# EAGLE schematic main (EAGLE 9.5.0)

## Sheet 1 of 7: ADE9000
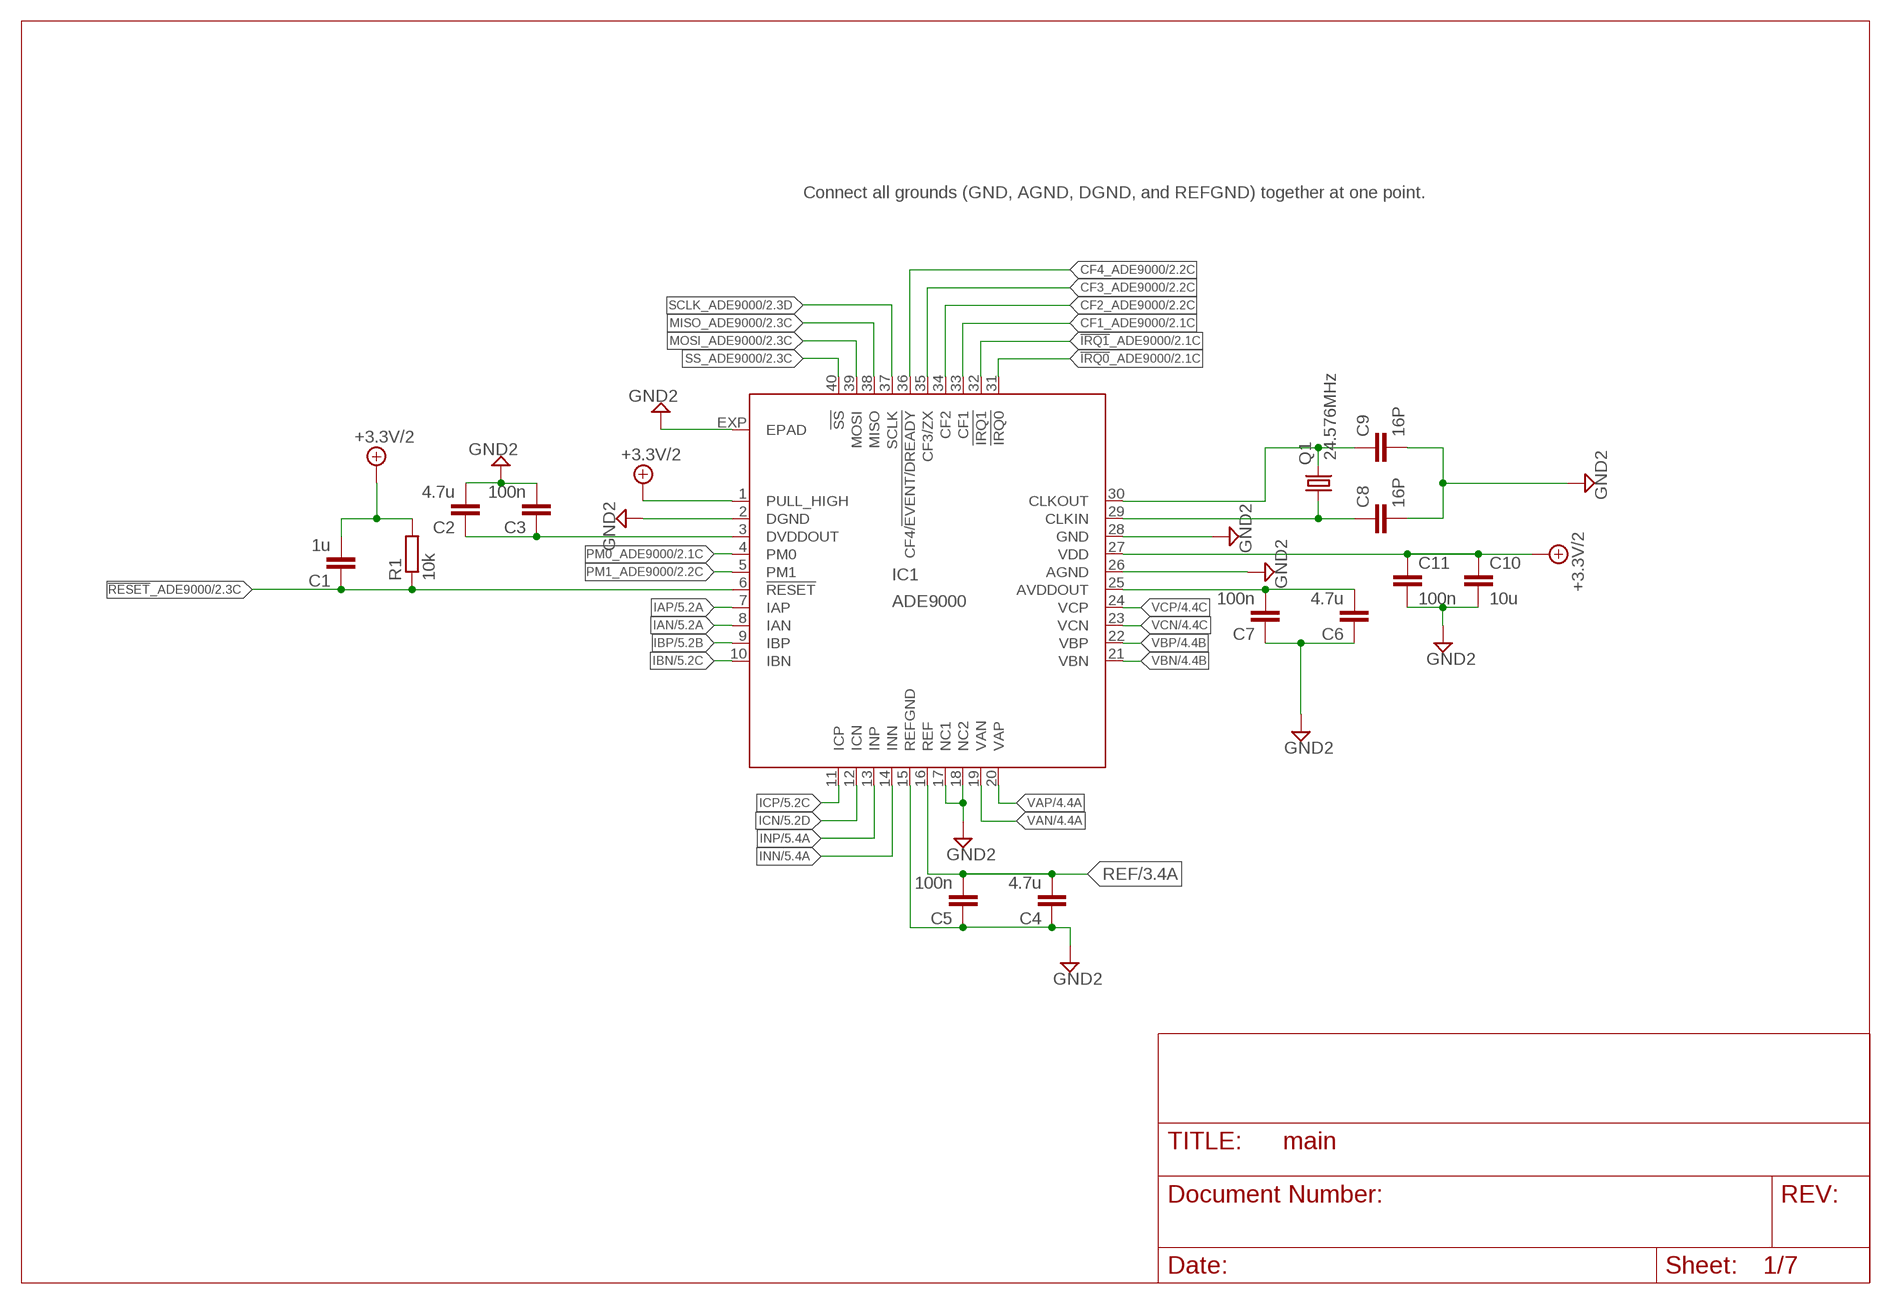
[diagram p0: schematic, sheet 1]

### Parts
C1  1u  C-EUC0805  [C0805]
C2  4.7u  C-EUC0805  [C0805]
C3  100n  C-EUC0805  [C0805]
C4  4.7u  C-EUC0805  [C0805]
C5  100n  C-EUC0805  [C0805]
C6  4.7u  C-EUC0805  [C0805]
C7  100n  C-EUC0805  [C0805]
C8  16P  C-EUC0805K  [C0805K]
C9  16P  C-EUC0805K  [C0805K]
C10  10u  C-EUC1206K  [C1206K]
C11  100n  C-EUC0805  [C0805]
IC1  ADE9000  [QFN40]
Q1  24.576MHz  CRYSTALHC49UP  [HC49UP]
R1  10k  R-EU_R0805  [R0805]

### Nets
!IRQ0!_ADE9000: IC1.31(!IRQ0) ; also sheet 2
!IRQ1!_ADE9000: IC1.32(!IRQ1) ; also sheet 2
!RESET!_ADE9000: C1.1 IC1.6(!RESET) R1.1 ; also sheet 2
+3.3V/2: C1.2 C10.1 C11.1 IC1.1(PULL_HIGH) IC1.27(VDD) R1.2 ; also sheet 2,3
CF1_ADE9000: IC1.33(CF1) ; also sheet 2
CF2_ADE9000: IC1.34(CF2) ; also sheet 2
CF3_ADE9000: IC1.35(CF3/ZX) ; also sheet 2
CF4_ADE9000: IC1.36(CF4/!EVENT/DREADY) ; also sheet 2
GND2: C2.2 C3.2 C4.1 C5.1 C6.1 C7.1 C8.2 C9.2 C10.2 C11.2 IC1.2(DGND) IC1.15(REFGND) IC1.17(NC1) IC1.18(NC2) IC1.26(AGND) IC1.28(GND) IC1.EXP(EPAD) ; also sheet 2,3,4,5
IAN: IC1.8(IAN) ; also sheet 5
IAP: IC1.7(IAP) ; also sheet 5
IBN: IC1.10(IBN) ; also sheet 5
IBP: IC1.9(IBP) ; also sheet 5
ICN: IC1.12(ICN) ; also sheet 5
ICP: IC1.11(ICP) ; also sheet 5
INN: IC1.14(INN) ; also sheet 5
INP: IC1.13(INP) ; also sheet 5
MISO_ADE9000: IC1.38(MISO) ; also sheet 2
MOSI_ADE9000: IC1.39(MOSI) ; also sheet 2
N$13: C2.1 C3.1 IC1.3(DVDDOUT)
N$21: C6.2 C7.2 IC1.25(AVDDOUT)
N$30: C8.1 IC1.29(CLKIN) Q1.1
N$31: C9.1 IC1.30(CLKOUT) Q1.2
PM0_ADE9000: IC1.4(PM0) ; also sheet 2
PM1_ADE9000: IC1.5(PM1) ; also sheet 2
REF: C4.2 C5.2 IC1.16(REF) ; also sheet 3
SCLK_ADE9000: IC1.37(SCLK) ; also sheet 2
SS_ADE9000: IC1.40(!SS) ; also sheet 2
VAN: IC1.19(VAN) ; also sheet 4
VAP: IC1.20(VAP) ; also sheet 4
VBN: IC1.21(VBN) ; also sheet 4
VBP: IC1.22(VBP) ; also sheet 4
VCN: IC1.23(VCN) ; also sheet 4
VCP: IC1.24(VCP) ; also sheet 4

### Notes on the sheet
- Connect all grounds (GND, AGND, DGND, and REFGND) together at one point.

## Sheet 2 of 7: Digital Isolators
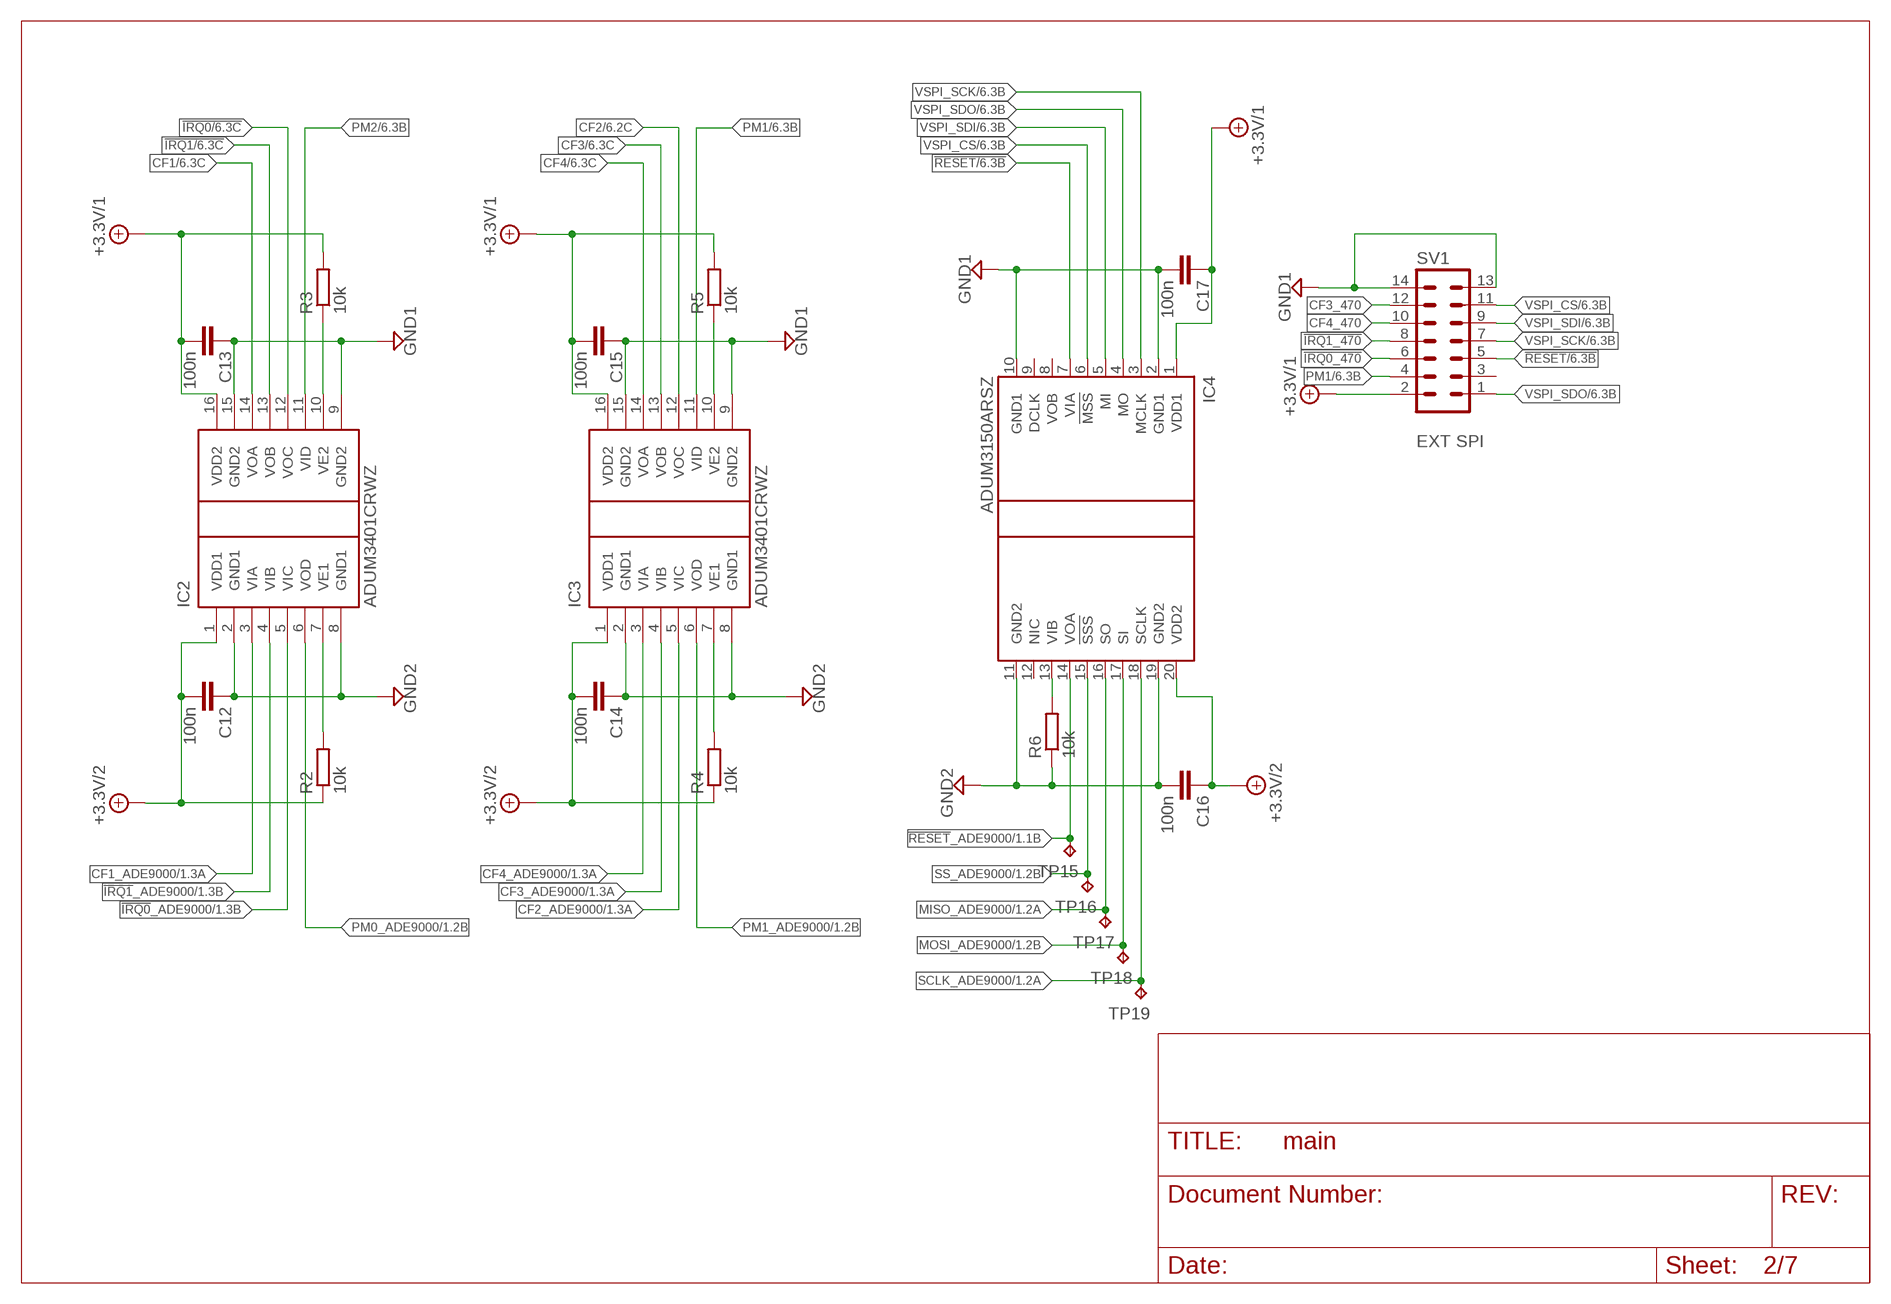
[diagram p1: schematic, sheet 2]

### Parts
C12  100n  C-EUC0805  [C0805]
C13  100n  C-EUC0805  [C0805]
C14  100n  C-EUC0805  [C0805]
C15  100n  C-EUC0805  [C0805]
C16  100n  C-EUC0805  [C0805]
C17  100n  C-EUC0805  [C0805]
IC2  ADUM3401CRWZ  ADUM3401  [SO16W]
IC3  ADUM3401CRWZ  ADUM3401  [SO16W]
IC4  ADUM3150ARSZ  ADUM3150  [SSOP20]
R2  10k  R-EU_R0805  [R0805]
R3  10k  R-EU_R0805  [R0805]
R4  10k  R-EU_R0805  [R0805]
R5  10k  R-EU_R0805  [R0805]
R6  10k  R-EU_R0805  [R0805]
SV1  EXT SPI  ML14  [ML14]
TP15  TPB1,27  [B1,27]
TP16  TPB1,27  [B1,27]
TP17  TPB1,27  [B1,27]
TP18  TPB1,27  [B1,27]
TP19  TPB1,27  [B1,27]

### Nets
!IRQ0: IC2.12(VOC) ; also sheet 6
!IRQ0!_ADE9000: IC2.5(VIC) ; also sheet 1
!IRQ0_470: SV1.6 ; also sheet 6
!IRQ1: IC2.13(VOB) ; also sheet 6
!IRQ1!_ADE9000: IC2.4(VIB) ; also sheet 1
!IRQ1_470: SV1.8 ; also sheet 6
!RESET: IC4.7(VIA) SV1.5 ; also sheet 6
!RESET!_ADE9000: IC4.14(VOA) TP15.TP ; also sheet 1
+3.3V/1: C13.2 C15.2 C17.1 IC2.16(VDD2) IC3.16(VDD2) IC4.1(VDD1) R3.2 R5.2 SV1.2 ; also sheet 3,6
+3.3V/2: C12.2 C14.2 C16.1 IC2.1(VDD1) IC3.1(VDD1) IC4.20(VDD2) R2.1 R4.1 ; also sheet 1,3
CF1: IC2.14(VOA) ; also sheet 6
CF1_ADE9000: IC2.3(VIA) ; also sheet 1
CF2: IC3.12(VOC) ; also sheet 6
CF2_ADE9000: IC3.5(VIC) ; also sheet 1
CF3: IC3.13(VOB) ; also sheet 6
CF3_470: SV1.12 ; also sheet 6
CF3_ADE9000: IC3.4(VIB) ; also sheet 1
CF4: IC3.14(VOA) ; also sheet 6
CF4_470: SV1.10 ; also sheet 6
CF4_ADE9000: IC3.3(VIA) ; also sheet 1
GND1: C13.1 C15.1 C17.2 IC2.9(GND2) IC2.15(GND2) IC3.9(GND2) IC3.15(GND2) IC4.2(GND1) IC4.10(GND1) SV1.13 SV1.14 ; also sheet 3,6,7
GND2: C12.1 C14.1 C16.2 IC2.2(GND1) IC2.8(GND1) IC3.2(GND1) IC3.8(GND1) IC4.11(GND2) IC4.19(GND2) R6.1 ; also sheet 1,3,4,5
MISO_ADE9000: IC4.16(SO) TP17.TP ; also sheet 1
MOSI_ADE9000: IC4.17(SI) TP18.TP ; also sheet 1
N$27: IC2.10(VE2) R3.1
N$29: IC4.13(VIB) R6.2
N$32: IC3.7(VE1) R4.2
N$33: IC3.10(VE2) R5.1
N$35: IC2.7(VE1) R2.2
PM0_ADE9000: IC2.6(VOD) ; also sheet 1
PM1: IC3.11(VID) SV1.4 ; also sheet 6
PM1_ADE9000: IC3.6(VOD) ; also sheet 1
PM2: IC2.11(VID) ; also sheet 6
SCLK_ADE9000: IC4.18(SCLK) TP19.TP ; also sheet 1
SS_ADE9000: IC4.15(!SSS) TP16.TP ; also sheet 1
VSPI_CS: IC4.6(!MSS) SV1.11 ; also sheet 6
VSPI_SCK: IC4.3(MCLK) SV1.7 ; also sheet 6
VSPI_SDI: IC4.5(MI) SV1.9 ; also sheet 6
VSPI_SDO: IC4.4(MO) SV1.1 ; also sheet 6
Unconnected: IC4.8(VOB) IC4.9(DCLK) IC4.12(NIC) SV1.3

## Sheet 3 of 7: Power Supply
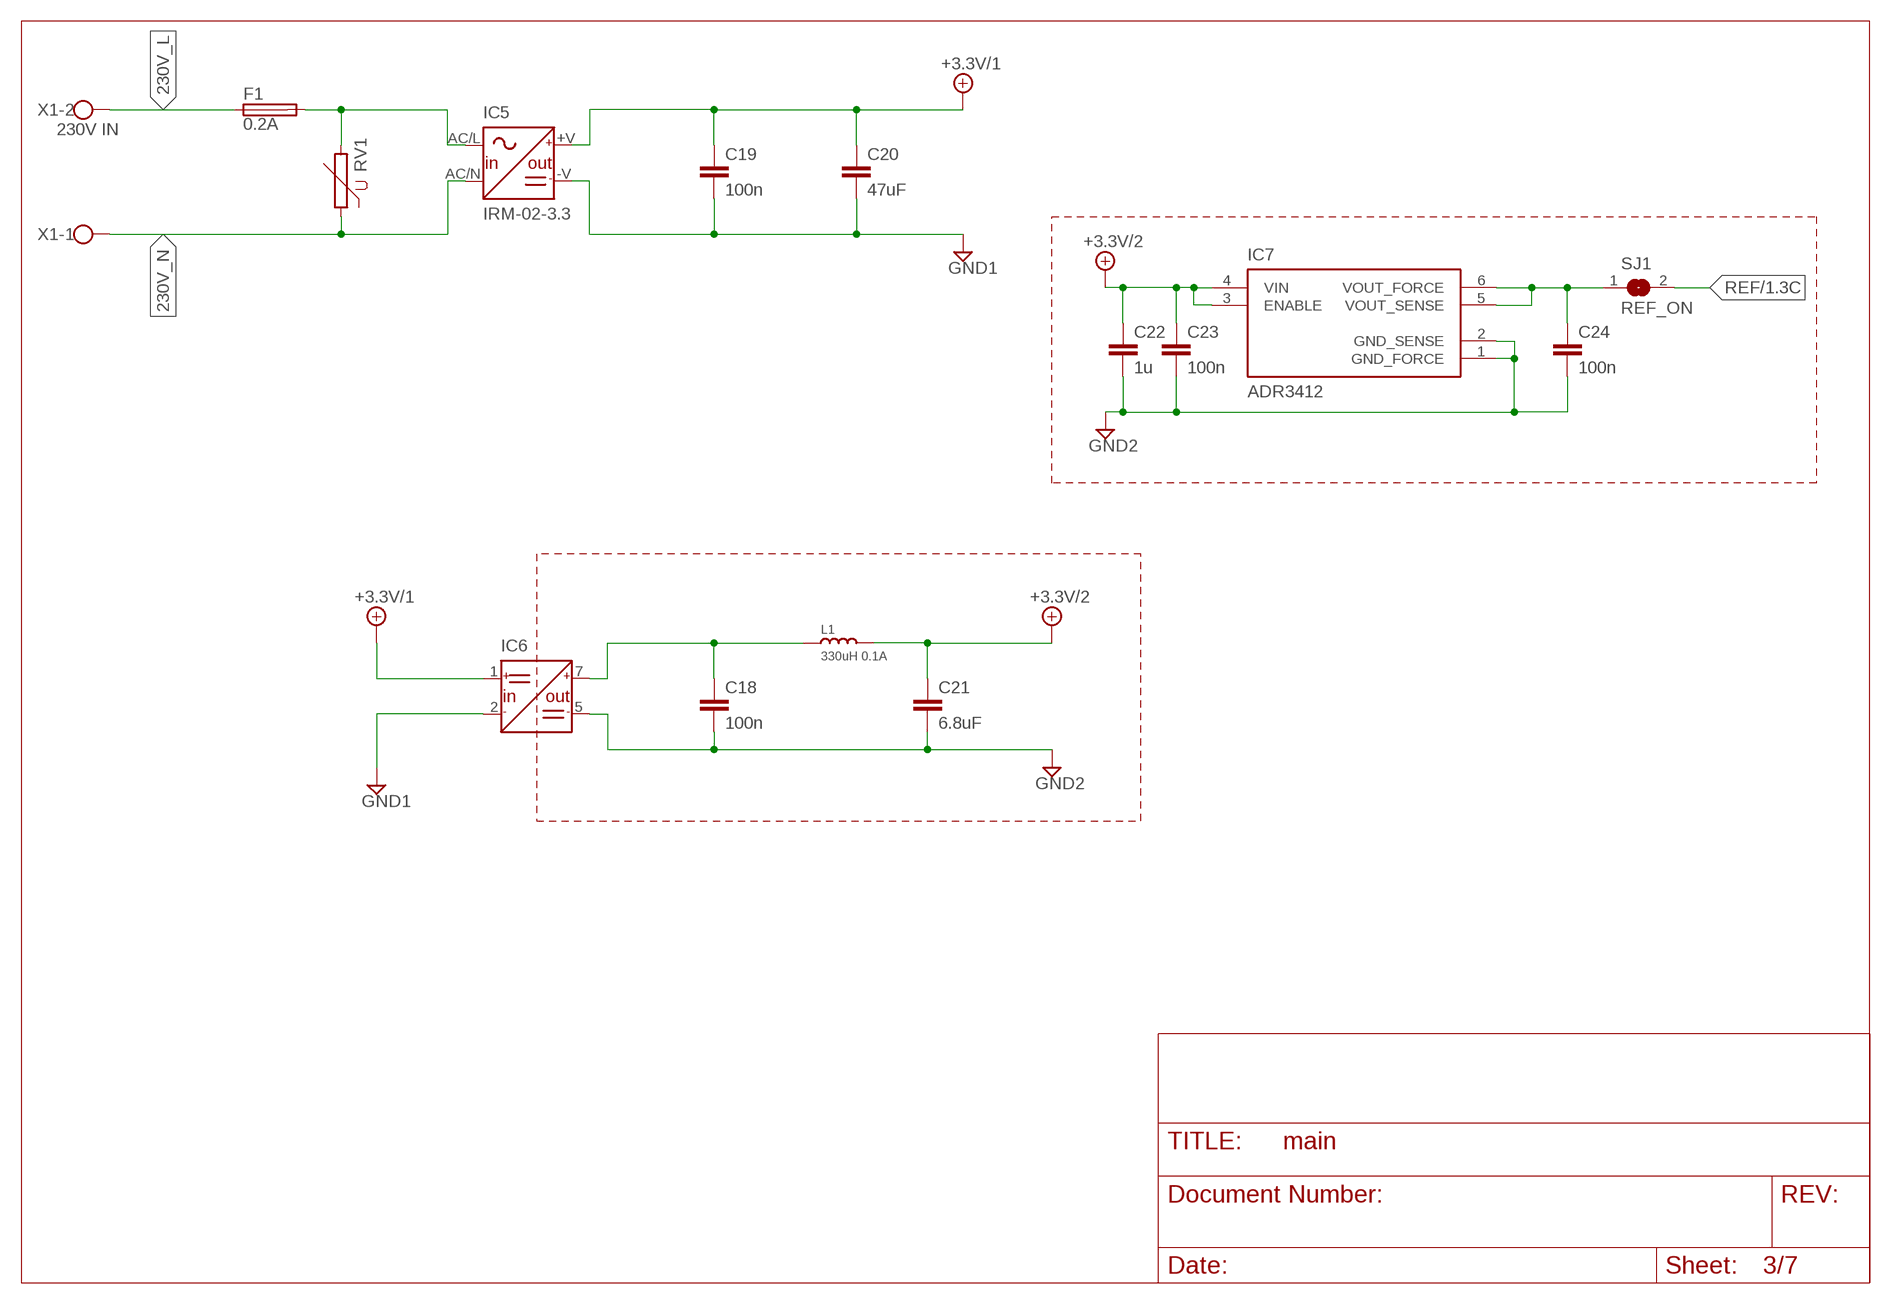
[diagram p2: schematic, sheet 3]

### Parts
C18  100n  C-EUC0805  [C0805]
C19  100n  C-EUC0805  [C0805]
C20  47uF  C-EUC3216  [C3216]
C21  6.8uF  C-EUC3216  [C3216]
C22  1u  C-EUC0805  [C0805]
C23  100n  C-EUC0805  [C0805]
C24  100n  C-EUC0805  [C0805]
F1  0.2A  FUSESH22,5A  [SH22,5A]
IC5  IRM-02-3.3  [MW_IRM-02]
IC6  MURATA-PS-MEF1SXXXXSP3C  [SIP-7PIN-1257]
IC7  ADR3412  [SOT-23-6]
L1  330uH 0.1A  SMD-INDUCTOR-4.7UH-20%-1.1A(1008)  [L1008]
RV1  B72210S0321K101  [TDK_E7.5_A2.4_W12.0_TH5.4_H15.0_D0.8]
SJ1  REF_ON  SJ  [SJ]
X1  230V IN  W237-113  [W237-113]

### Nets
230V_L: F1.1 X1.2
230V_N: IC5.AC/N(N) RV1.1 X1.1
+3.3V/1: C19.1 C20.1 IC5.+V(+V_OUT) IC6.1(+V_IN) ; also sheet 2,6
+3.3V/2: C21.1 C22.1 C23.1 IC7.3(ENABLE) IC7.4(VIN) L1.2 ; also sheet 1,2
GND1: C19.2 C20.2 IC5.-V(-V_OUT) IC6.2(-V_IN) ; also sheet 2,6,7
GND2: C18.2 C21.2 C22.2 C23.2 C24.2 IC6.5(-V_OUT) IC7.1(GND_FORCE) IC7.2(GND_SENSE) ; also sheet 1,2,4,5
N$20: C18.1 IC6.7(+V_OUT) L1.1
N$23: F1.2 IC5.AC/L(L) RV1.2
N$36: C24.1 IC7.5(VOUT_SENSE) IC7.6(VOUT_FORCE) SJ1.1
REF: SJ1.2 ; also sheet 1

## Sheet 4 of 7: Voltage ADC Front-end
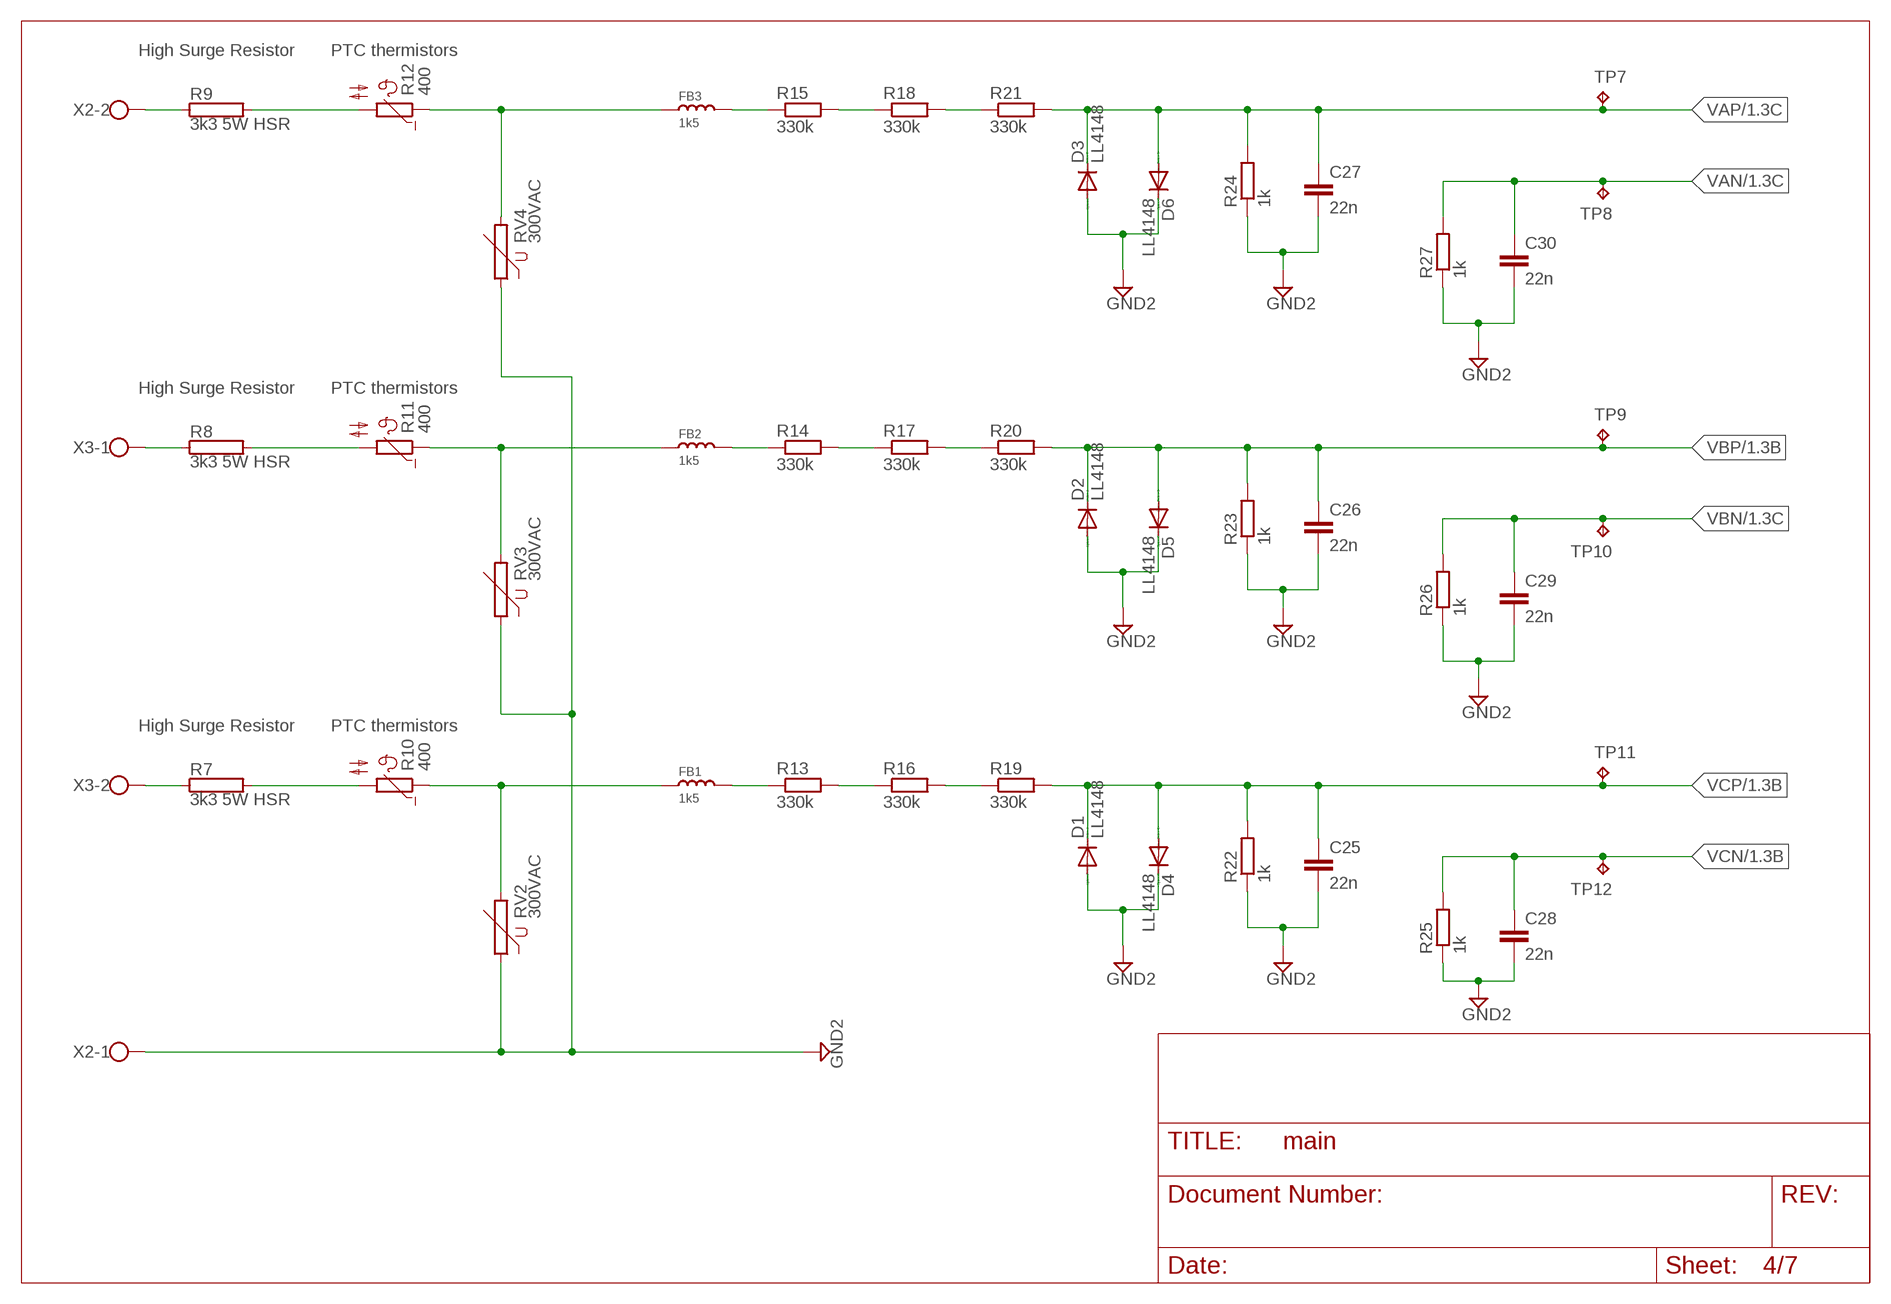
[diagram p3: schematic, sheet 4]

### Parts
C25  22n  C-EUC0805  [C0805]
C26  22n  C-EUC0805  [C0805]
C27  22n  C-EUC0805  [C0805]
C28  22n  C-EUC0805  [C0805]
C29  22n  C-EUC0805  [C0805]
C30  22n  C-EUC0805  [C0805]
D1  LL4148  DIODE-SOD80C  [SOD80C]
D2  LL4148  DIODE-SOD80C  [SOD80C]
D3  LL4148  DIODE-SOD80C  [SOD80C]
D4  LL4148  DIODE-SOD80C  [SOD80C]
D5  LL4148  DIODE-SOD80C  [SOD80C]
D6  LL4148  DIODE-SOD80C  [SOD80C]
FB1  1k5  SMD-FERRITE-BEAD-30R-3A(0805)  [L0805]
FB2  1k5  SMD-FERRITE-BEAD-30R-3A(0805)  [L0805]
FB3  1k5  SMD-FERRITE-BEAD-30R-3A(0805)  [L0805]
R7  3k3 5W HSR  RAC05  [AC05]
R8  3k3 5W HSR  RAC05  [AC05]
R9  3k3 5W HSR  RAC05  [AC05]
R10  400  PTCCL10H010SBE  [PTCCL10H010SBE]
R11  400  PTCCL10H010SBE  [PTCCL10H010SBE]
R12  400  PTCCL10H010SBE  [PTCCL10H010SBE]
R13  330k  R-EU_R1206  [R1206]
R14  330k  R-EU_R1206  [R1206]
R15  330k  R-EU_R1206  [R1206]
R16  330k  R-EU_R1206  [R1206]
R17  330k  R-EU_R1206  [R1206]
R18  330k  R-EU_R1206  [R1206]
R19  330k  R-EU_R1206  [R1206]
R20  330k  R-EU_R1206  [R1206]
R21  330k  R-EU_R1206  [R1206]
R22  1k  R-EU_R1206  [R1206]
R23  1k  R-EU_R1206  [R1206]
R24  1k  R-EU_R1206  [R1206]
R25  1k  R-EU_R1206  [R1206]
R26  1k  R-EU_R1206  [R1206]
R27  1k  R-EU_R1206  [R1206]
RV2  300VAC  B72220S0301K101  [TDK_E10.0_A2.4_W21.5_TH5.6_H25.5_D1.0]
RV3  300VAC  B72220S0301K101  [TDK_E10.0_A2.4_W21.5_TH5.6_H25.5_D1.0]
RV4  300VAC  B72220S0301K101  [TDK_E10.0_A2.4_W21.5_TH5.6_H25.5_D1.0]
TP7  TPB1,27  [B1,27]
TP8  TPB1,27  [B1,27]
TP9  TPB1,27  [B1,27]
TP10  TPB1,27  [B1,27]
TP11  TPB1,27  [B1,27]
TP12  TPB1,27  [B1,27]
X2  W237-113  [W237-113]
X3  W237-113  [W237-113]

### Nets
GND2: C25.2 C26.2 C27.2 C28.2 C29.2 C30.2 D1.A D2.A D3.A D4.C D5.C D6.C R22.1 R23.1 R24.1 R25.1 R26.1 R27.1 RV2.1 RV3.1 RV4.1 X2.1 ; also sheet 1,2,3,5
N$1: R9.2 R12.2
N$2: FB3.1 R12.1 RV4.2
N$4: FB3.2 R15.1
N$5: R8.2 R11.2
N$6: FB2.1 R11.1 RV3.2
N$7: R7.1 X3.2
N$8: R15.2 R18.1
N$9: FB2.2 R14.1
N$10: R14.2 R17.1
N$11: R17.2 R20.1
N$12: R18.2 R21.1
N$14: R7.2 R10.2
N$15: FB1.1 R10.1 RV2.2
N$16: R8.1 X3.1
N$17: FB1.2 R13.1
N$18: R13.2 R16.1
N$19: R16.2 R19.1
N$53: R9.1 X2.2
VAN: C30.1 R27.2 TP8.TP ; also sheet 1
VAP: C27.1 D3.C D6.A R21.2 R24.2 TP7.TP ; also sheet 1
VBN: C29.1 R26.2 TP10.TP ; also sheet 1
VBP: C26.1 D2.C D5.A R20.2 R23.2 TP9.TP ; also sheet 1
VCN: C28.1 R25.2 TP12.TP ; also sheet 1
VCP: C25.1 D1.C D4.A R19.2 R22.2 TP11.TP ; also sheet 1

### Notes on the sheet
- High Surge Resistor | PTC thermistors
- High Surge Resistor | PTC thermistors
- High Surge Resistor | PTC thermistors

## Sheet 5 of 7: CurrentADC Front-end
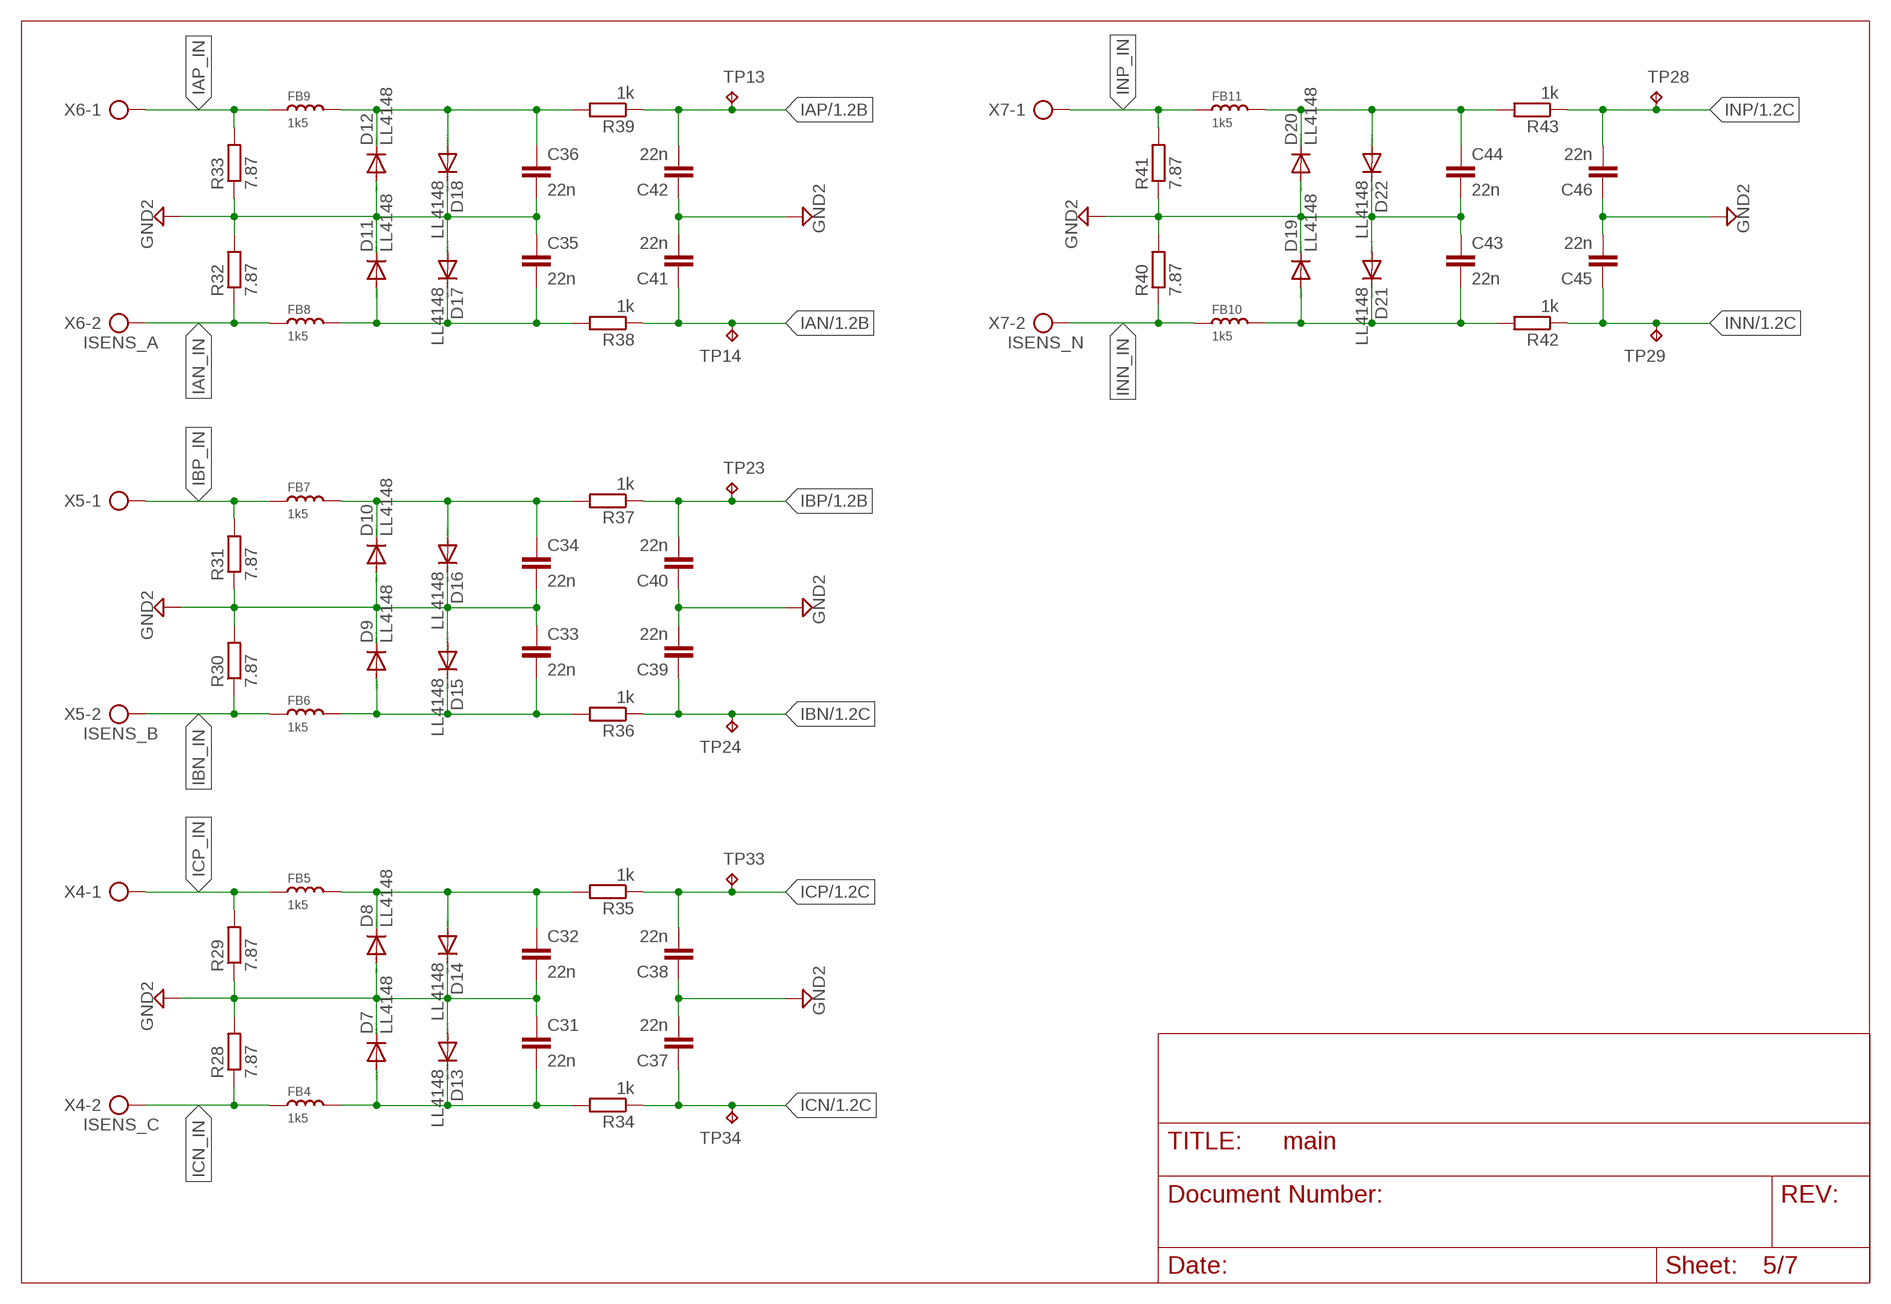
[diagram p4: schematic, sheet 5]

### Parts
C31  22n  C-EUC0805  [C0805]
C32  22n  C-EUC0805  [C0805]
C33  22n  C-EUC0805  [C0805]
C34  22n  C-EUC0805  [C0805]
C35  22n  C-EUC0805  [C0805]
C36  22n  C-EUC0805  [C0805]
C37  22n  C-EUC0805  [C0805]
C38  22n  C-EUC0805  [C0805]
C39  22n  C-EUC0805  [C0805]
C40  22n  C-EUC0805  [C0805]
C41  22n  C-EUC0805  [C0805]
C42  22n  C-EUC0805  [C0805]
C43  22n  C-EUC0805  [C0805]
C44  22n  C-EUC0805  [C0805]
C45  22n  C-EUC0805  [C0805]
C46  22n  C-EUC0805  [C0805]
D7  LL4148  DIODE-SOD80C  [SOD80C]
D8  LL4148  DIODE-SOD80C  [SOD80C]
D9  LL4148  DIODE-SOD80C  [SOD80C]
D10  LL4148  DIODE-SOD80C  [SOD80C]
D11  LL4148  DIODE-SOD80C  [SOD80C]
D12  LL4148  DIODE-SOD80C  [SOD80C]
D13  LL4148  DIODE-SOD80C  [SOD80C]
D14  LL4148  DIODE-SOD80C  [SOD80C]
D15  LL4148  DIODE-SOD80C  [SOD80C]
D16  LL4148  DIODE-SOD80C  [SOD80C]
D17  LL4148  DIODE-SOD80C  [SOD80C]
D18  LL4148  DIODE-SOD80C  [SOD80C]
D19  LL4148  DIODE-SOD80C  [SOD80C]
D20  LL4148  DIODE-SOD80C  [SOD80C]
D21  LL4148  DIODE-SOD80C  [SOD80C]
D22  LL4148  DIODE-SOD80C  [SOD80C]
FB4  1k5  SMD-FERRITE-BEAD-30R-3A(0805)  [L0805]
FB5  1k5  SMD-FERRITE-BEAD-30R-3A(0805)  [L0805]
FB6  1k5  SMD-FERRITE-BEAD-30R-3A(0805)  [L0805]
FB7  1k5  SMD-FERRITE-BEAD-30R-3A(0805)  [L0805]
FB8  1k5  SMD-FERRITE-BEAD-30R-3A(0805)  [L0805]
FB9  1k5  SMD-FERRITE-BEAD-30R-3A(0805)  [L0805]
FB10  1k5  SMD-FERRITE-BEAD-30R-3A(0805)  [L0805]
FB11  1k5  SMD-FERRITE-BEAD-30R-3A(0805)  [L0805]
R28  7.87  R-EU_R1206  [R1206]
R29  7.87  R-EU_R1206  [R1206]
R30  7.87  R-EU_R1206  [R1206]
R31  7.87  R-EU_R1206  [R1206]
R32  7.87  R-EU_R1206  [R1206]
R33  7.87  R-EU_R1206  [R1206]
R34  1k  R-EU_R1206  [R1206]
R35  1k  R-EU_R1206  [R1206]
R36  1k  R-EU_R1206  [R1206]
R37  1k  R-EU_R1206  [R1206]
R38  1k  R-EU_R1206  [R1206]
R39  1k  R-EU_R1206  [R1206]
R40  7.87  R-EU_R1206  [R1206]
R41  7.87  R-EU_R1206  [R1206]
R42  1k  R-EU_R1206  [R1206]
R43  1k  R-EU_R1206  [R1206]
TP13  TPB1,27  [B1,27]
TP14  TPB1,27  [B1,27]
TP23  TPB1,27  [B1,27]
TP24  TPB1,27  [B1,27]
TP28  TPB1,27  [B1,27]
TP29  TPB1,27  [B1,27]
TP33  TPB1,27  [B1,27]
TP34  TPB1,27  [B1,27]
X4  ISENS_C  AK500/2  [AK500/2]
X5  ISENS_B  AK500/2  [AK500/2]
X6  ISENS_A  AK500/2  [AK500/2]
X7  ISENS_N  AK500/2  [AK500/2]

### Nets
GND2: C31.1 C32.2 C33.1 C34.2 C35.1 C36.2 C37.2 C38.1 C39.2 C40.1 C41.2 C42.1 C43.1 C44.2 C45.2 C46.1 D7.C D8.A D9.C D10.A D11.C D12.A D13.A D14.C D15.A D16.C D17.A D18.C D19.C D20.A D21.A D22.C R28.2 R29.1 R30.2 R31.1 R32.2 R33.1 R40.2 R41.1 ; also sheet 1,2,3,4
IAN: C41.1 R38.1 TP14.TP ; also sheet 1
IAN_IN: FB8.1 R32.1 X6.2
IAP: C42.2 R39.1 TP13.TP ; also sheet 1
IAP_IN: FB9.1 R33.2 X6.1
IBN: C39.1 R36.1 TP24.TP ; also sheet 1
IBN_IN: FB6.1 R30.1 X5.2
IBP: C40.2 R37.1 TP23.TP ; also sheet 1
IBP_IN: FB7.1 R31.2 X5.1
ICN: C37.1 R34.1 TP34.TP ; also sheet 1
ICN_IN: FB4.1 R28.1 X4.2
ICP: C38.2 R35.1 TP33.TP ; also sheet 1
ICP_IN: FB5.1 R29.2 X4.1
INN: C45.1 R42.1 TP29.TP ; also sheet 1
INN_IN: FB10.1 R40.1 X7.2
INP: C46.2 R43.1 TP28.TP ; also sheet 1
INP_IN: FB11.1 R41.2 X7.1
N$22: C33.2 D9.A D15.C FB6.2 R36.2
N$24: C43.2 D19.A D21.C FB10.2 R42.2
N$25: C31.2 D7.A D13.C FB4.2 R34.2
N$28: C35.2 D11.A D17.C FB8.2 R38.2
VBN1: C36.1 D12.C D18.A FB9.2 R39.2
VBN2: C34.1 D10.C D16.A FB7.2 R37.2
VBN3: C44.1 D20.C D22.A FB11.2 R43.2
VBN4: C32.1 D8.C D14.A FB5.2 R35.2

## Sheet 6 of 7: ESP32
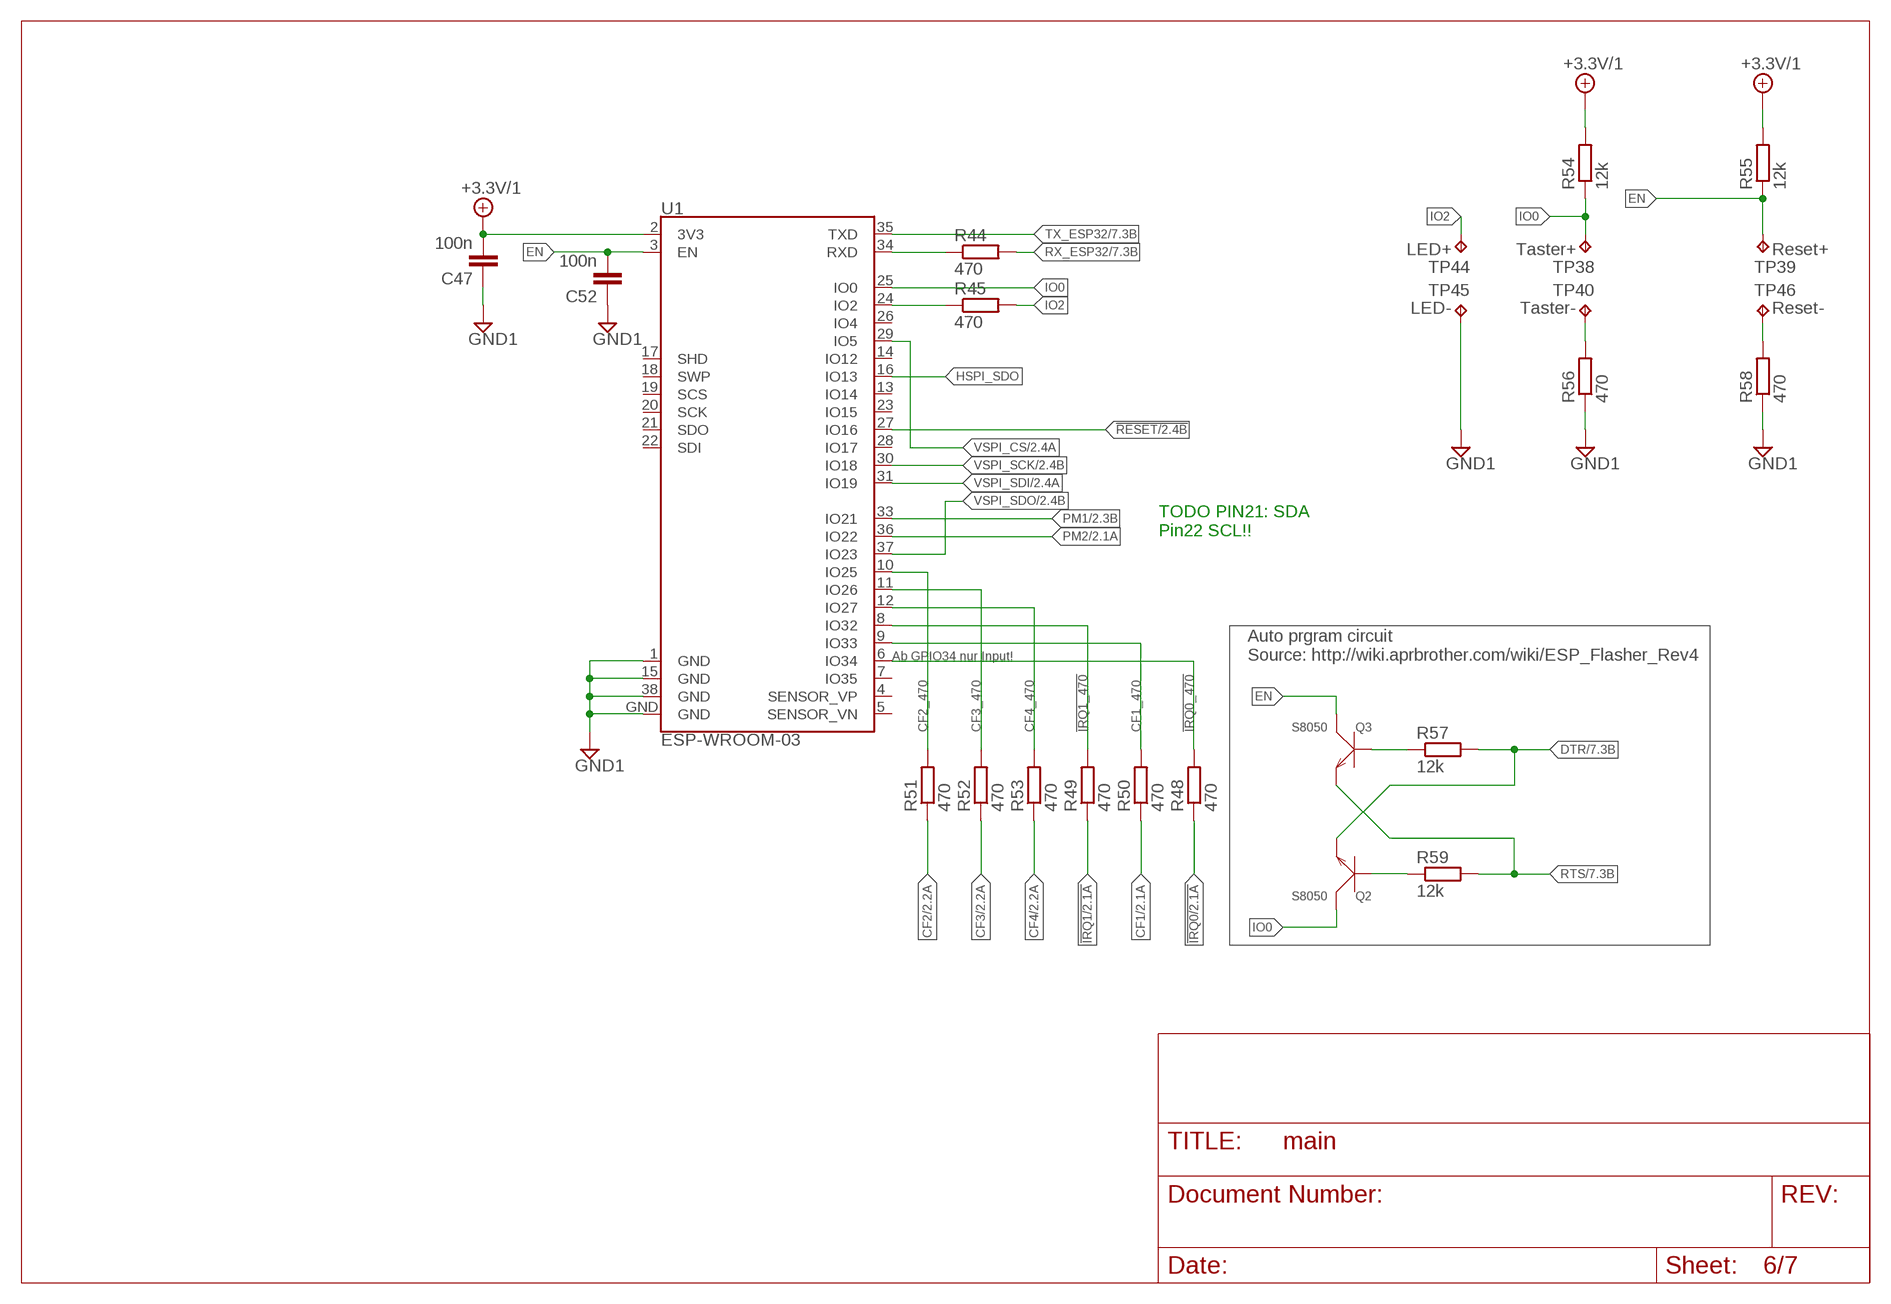
[diagram p5: schematic, sheet 6]

### Parts
C47  100n  C-EUC0805  [C0805]
C52  100n  C-EUC0805  [C0805]
Q2  S8050  SMD-TRANSISTORS-NPN-25V-500MW-S8050(SOT-23)  [SOT-23]
Q3  S8050  SMD-TRANSISTORS-NPN-25V-500MW-S8050(SOT-23)  [SOT-23]
R44  470  R-EU_R0805  [R0805]
R45  470  R-EU_R0805  [R0805]
R48  470  R-EU_R0805  [R0805]
R49  470  R-EU_R0805  [R0805]
R50  470  R-EU_R0805  [R0805]
R51  470  R-EU_R0805  [R0805]
R52  470  R-EU_R0805  [R0805]
R53  470  R-EU_R0805  [R0805]
R54  12k  R-EU_R0805  [R0805]
R55  12k  R-EU_R0805  [R0805]
R56  470  R-EU_R0805  [R0805]
R57  12k  R-EU_R0805  [R0805]
R58  470  R-EU_R0805  [R0805]
R59  12k  R-EU_R0805  [R0805]
TP38  TPPAD1-13Y  [P1-13Y]
TP39  TPPAD1-13Y  [P1-13Y]
TP40  TPPAD1-13Y  [P1-13Y]
TP44  TPPAD1-13Y  [P1-13Y]
TP45  TPPAD1-13Y  [P1-13Y]
TP46  TPPAD1-13Y  [P1-13Y]
U1  ESP-WROOM-03  [ESP-WROOM-03]

### Nets
!IRQ0: R48.1 ; also sheet 2
!IRQ0_470: R48.2 U1.6(IO34) ; also sheet 2
!IRQ1: R49.1 ; also sheet 2
!IRQ1_470: R49.2 U1.8(IO32) ; also sheet 2
!RESET: U1.27(IO16) ; also sheet 2
+3.3V/1: C47.2 R54.2 R55.2 U1.2(3V3) ; also sheet 2,3
CF1: R50.1 ; also sheet 2
CF1_470: R50.2 U1.9(IO33)
CF2: R51.1 ; also sheet 2
CF2_470: R51.2 U1.10(IO25)
CF3: R52.1 ; also sheet 2
CF3_470: R52.2 U1.11(IO26) ; also sheet 2
CF4: R53.1 ; also sheet 2
CF4_470: R53.2 U1.12(IO27) ; also sheet 2
DTR: Q2.2(E) R57.2 ; also sheet 7
EN: C52.2 Q3.3(C) R55.1 TP39.TP U1.3(EN)
GND1: C47.1 C52.1 R56.1 R58.1 TP45.TP U1.1(GND) U1.15(GND) U1.38(GND) U1.GND ; also sheet 2,3,7
HSPI_SDO: U1.16(IO13)
IO0: Q2.3(C) R54.1 TP38.TP U1.25(IO0)
IO2: R45.2 TP44.TP
N$26: R44.1 U1.34(RXD)
N$38: R45.1 U1.24(IO2)
N$39: Q3.1(B) R57.1
N$40: Q2.1(B) R59.1
N$41: R56.2 TP40.TP
N$42: R58.2 TP46.TP
PM1: U1.33(IO21) ; also sheet 2
PM2: U1.36(IO22) ; also sheet 2
RTS: Q3.2(E) R59.2 ; also sheet 7
RX_ESP32: R44.2 ; also sheet 7
TX_ESP32: U1.35(TXD) ; also sheet 7
VSPI_CS: U1.29(IO5) ; also sheet 2
VSPI_SCK: U1.30(IO18) ; also sheet 2
VSPI_SDI: U1.31(IO19) ; also sheet 2
VSPI_SDO: U1.37(IO23) ; also sheet 2
Unconnected: U1.4(SENSOR_VP) U1.5(SENSOR_VN) U1.7(IO35) U1.13(IO14) U1.14(IO12) U1.17(SHD) U1.18(SWP) U1.19(SCS) U1.20(SCK) U1.21(SDO) U1.22(SDI) U1.23(IO15) U1.26(IO4) U1.28(IO17)

### Notes on the sheet
- TODO PIN21: SDA
  Pin22 SCL!!
- Ab GPIO34 nur Input!
- Auto prgram circuit
  Source: http://wiki.aprbrother.com/wiki/ESP_Flasher_Rev4

## Sheet 7 of 7: USB UART
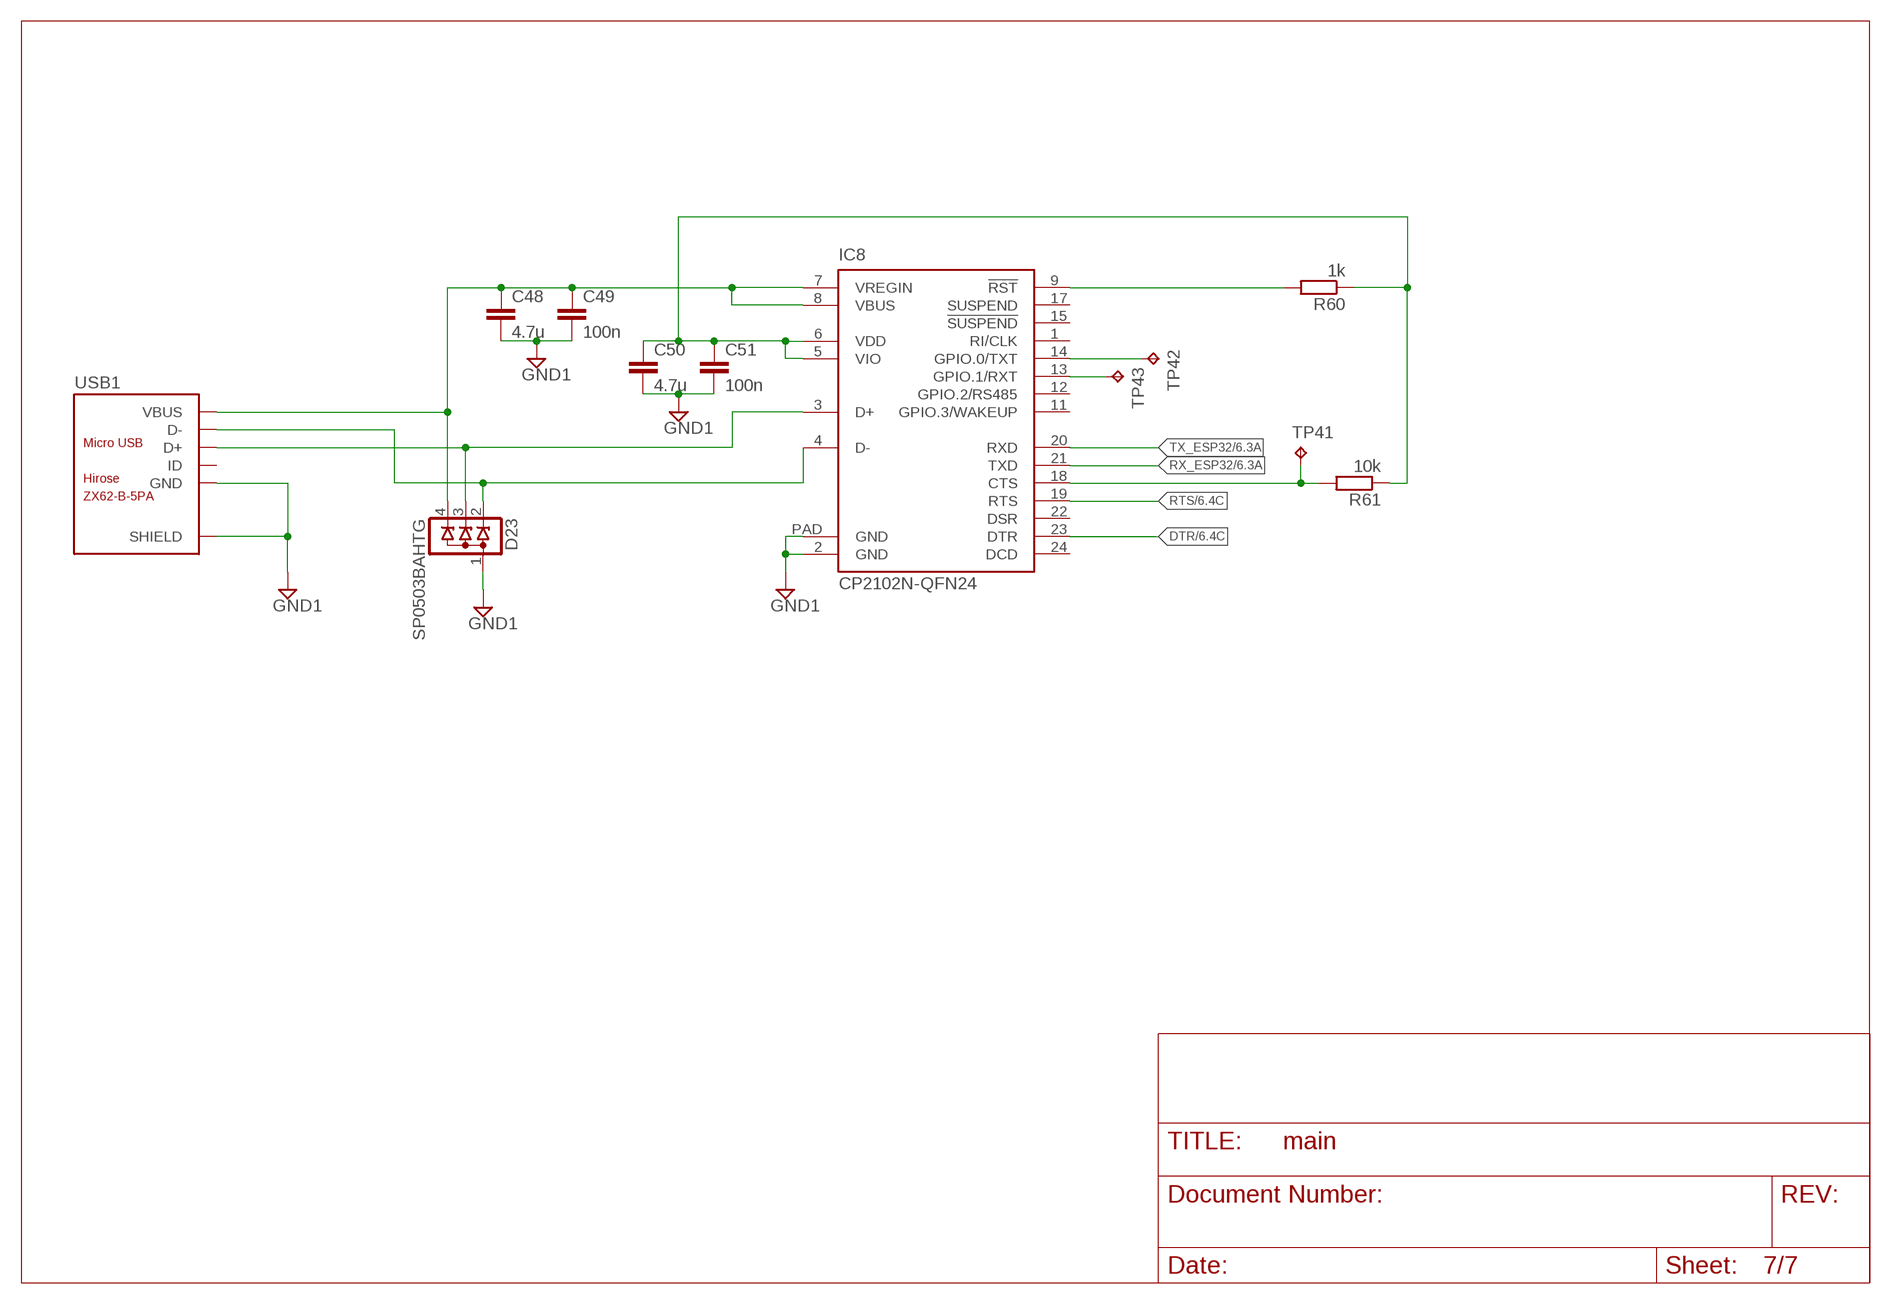
[diagram p6: schematic, sheet 7]

### Parts
C48  4.7u  C-EUC0805  [C0805]
C49  100n  C-EUC0805  [C0805]
C50  4.7u  C-EUC0805  [C0805]
C51  100n  C-EUC0805  [C0805]
D23  SP0503BAHTG  [SOT143-4-R]
IC8  CP2102N-QFN24  [QFN24]
R60  1k  R-EU_R0805  [R0805]
R61  10k  R-EU_R0805  [R0805]
TP41  TPB1,27  [B1,27]
TP42  TPB1,27  [B1,27]
TP43  TPB1,27  [B1,27]
USB1  ZX62-B-5PA  MICRO-USB-SMD(ZX62-B-5PA)  [MICRO-USB5+6P-SMD-0.65-AB]

### Nets
CP2102_3.3V: C50.1 C51.1 IC8.5(VIO) IC8.6(VDD) R60.1 R61.1
DTR: IC8.23(DTR) ; also sheet 6
GND1: C48.2 C49.2 C50.2 C51.2 D23.1 IC8.2(GND) IC8.PAD(GND) USB1.5(GND) USB1.P1(SHIELD) USB1.P2(SHIELD) USB1.P3(SHIELD) USB1.P4(SHIELD) USB1.P5(SHIELD) USB1.P6(SHIELD) ; also sheet 2,3,6
N$44: IC8.18(CTS) R61.2 TP41.TP
N$45: IC8.9(!RST) R60.2
N$49: IC8.14(GPIO.0/TXT) TP42.TP
N$50: IC8.13(GPIO.1/RXT) TP43.TP
RTS: IC8.19(RTS) ; also sheet 6
RX_ESP32: IC8.21(TXD) ; also sheet 6
TX_ESP32: IC8.20(RXD) ; also sheet 6
USB_D+: D23.3 IC8.3(D+) USB1.3(D+)
USB_D-: D23.2 IC8.4(D-) USB1.2(D-)
VBUS: C48.1 C49.1 D23.4 IC8.7(VREGIN) IC8.8(VBUS) USB1.1(VBUS)
Unconnected: IC8.1(RI/CLK) IC8.11(GPIO.3/WAKEUP) IC8.12(GPIO.2/RS485) IC8.15(!SUSPEND) IC8.17(SUSPEND) IC8.22(DSR) IC8.24(DCD) USB1.4(ID)

## Library data of the parts
C1 C22 = resistor:C-EU: CAPACITOR, European symbol; OC_MOUSER: 77-VJ0805Y105KXQTBC
C2 C4 C6 C48 C50 = resistor:C-EU: CAPACITOR, European symbol; OC_MOUSER: 81-GRM21R61A475KE34D
C3 C5 C7 C11-C19 C23 C24 C47 C49 C51 C52 = resistor:C-EU: CAPACITOR, European symbol; OC_MOUSER: 80-C0805C104K3R
C8 C9 = rcl:C-EU: CAPACITOR, European symbol; OC_MOUSER: 609-251R15S160JV4E
C10 = resistor:C-EU: CAPACITOR, European symbol; OC_MOUSER: 81-GRM319R6YA106KA2D
C20 = resistor:C-EU: CAPACITOR, European symbol; OC_MOUSER: 74-T55A476M6R3C0070
C21 = resistor:C-EU: CAPACITOR, European symbol; OC_MOUSER: 74-T55A685M010C0300
C25-C30 = resistor:C-EU: CAPACITOR, European symbol; OC_MOUSER: C2012C0G1H223J125AA
C31-C46 = resistor:C-EU: CAPACITOR, European symbol; OC_MOUSER: 810-C2012C0G1H223J
D1-D22 = diode:DIODE-: DIODE; OC_MOUSER: 512-LL4148
D23 = littelfuse_greg:SP0503BA: SP05 Series - 30pF 30kV Unidirectional TVS Array; OC_MOUSER: 576-SP0503BAHTG
F1 = fuse:FUSE: Fuse; OC_FARNELL: unknown; OC_MOUSER: 576-65600001409 & 576-65900000009; OC_NEWARK: unknown
FB1-FB11 = Seeed-OPL-Inductor:SMD-FERRITE-BEAD-30R-3A(0805): 303030023; MPN: MH2029-300Y; OC_MOUSER: 81-BLM21BD152SN1D; VALUE: 30R 3A
IC1 = ade9000:ADE9000; OC_MOUSER: 584-ADE9000ACPZ
IC2 IC3 = analog-devices2:ADUM3401; OC_MOUSER: 584-ADUM3401CRWZ
IC4 = analog-devices2:ADUM3150; OC_MOUSER: 584-ADUM3150ARSZ
IC5 = reichelt_power:IRM-02: MEAN WELL AC/DC Power Modules 2W Soruce: http://meanwellusa.com/productPdf.aspx?i=675; OC_MOUSER: 709-IRM02-3.3
IC6 = reichelt_power:MURATA-PS-MEF1SXXXX: Murata Power Solutions, MEF1 Series Isolation options: 1 kVDC MEF1xxxxxSPC 3.5 kVDC MEF1xxxxxSP3C; OC_MOUSER: 580-MEF1S0303SP3C
IC7 = analog-devices2:ADR3412; OC_MOUSER: 584-ADR3412ARJZ-R7
IC8 = silabs_greg:CP2102N-QFN24: Single-Chip USB to UART Bridge Source: USBXpress™ Family CP2102N Data Sheet <https://www.silabs.com/documents/public/data-sheets/cp2102n-datasheet.pdf>; OC_MOUSER: 634-CP2102NA01GQFN24
L1 = Seeed-OPL-Inductor:SMD-INDUCTOR-4.7UH-20%-1.1A(1008): 303010149; MPN: CIG22L4R7MNE; OC_MOUSER: 963-CBC2518T331M; VALUE: 4.7uh 1.1A
Q1 = crystal:CRYSTAL: CRYSTAL; OC_FARNELL: unknown; OC_MOUSER: 815-ABLS2-24.5-D4YFT; OC_NEWARK: unknown
Q2 Q3 = Seeed-OPL-Transistor:SMD-TRANSISTORS-NPN-25V-500MW-S8050(SOT-23): 305010017; MPN: S8050; OC_MOUSER: 833-MMSS8050-L-TP
R1-R6 R61 = resistor:R-EU_: RESISTOR, European symbol; OC_MOUSER: 603-RC0805FR-0710KL
R7-R9 = resistor-power:R: Power Resitor; OC_FARNELL: unknown; OC_MOUSER: 652-WS5M3301J; OC_NEWARK: unknown
R10-R12 = ptc-ntc:PTCCL10H010SBE: Vishay PTC; OC_MOUSER: 594-2381-661-93113
R13-R21 = resistor:R-EU_: RESISTOR, European symbol; OC_MOUSER: 71-TNPV1206330KBEEN
R22-R27 R34-R39 R42 R43 = resistor:R-EU_: RESISTOR, European symbol; OC_MOUSER: 667-ERA-8ARB102V
R28-R33 R40 R41 = resistor:R-EU_: RESISTOR, European symbol; OC_MOUSER: 279-RP73D2B7R87BTG
R44 R45 R48-R53 R56 R58 = resistor:R-EU_: RESISTOR, European symbol; OC_MOUSER: 603-RC0805FR-07470RL
R54 R55 R57 R59 = resistor:R-EU_: RESISTOR, European symbol; OC_MOUSER: 652-CR0805-JW-123ELF
R60 = resistor:R-EU_: RESISTOR, European symbol; OC_MOUSER: 71-CRCW0805-1.0K-E3
RV1 = varistor_greg:B722*: VARISTOR TDK StandarD series B722 TODO; OC_MOUSER: 871-B72210S321K101
RV2-RV4 = varistor_greg:B722*: VARISTOR TDK StandarD series B722 TODO; OC_MOUSER: B72220S0301K101
SJ1 = jumper:SJ: SMD solder JUMPER
SV1 = con-harting-ml:ML14: HARTING; OC_FARNELL: unknown; OC_NEWARK: unknown
TP7-TP19 TP23 TP24 TP28 TP29 TP33 TP34 TP41-TP43 = testpad:TP: Test pad
TP38 = testpad:TP: Test pad; TP_SIGNAL_NAME: Taster+
TP39 = testpad:TP: Test pad; TP_SIGNAL_NAME: Reset+
TP40 = testpad:TP: Test pad; TP_SIGNAL_NAME: Taster-
TP44 = testpad:TP: Test pad; TP_SIGNAL_NAME: LED+
TP45 = testpad:TP: Test pad; TP_SIGNAL_NAME: LED-
TP46 = testpad:TP: Test pad; TP_SIGNAL_NAME: Reset-
U1 = esp32:ESP-WROOM-03
USB1 = Seeed-OPL-Connector:MICRO-USB-SMD(ZX62-B-5PA): 320010005; MPN: ZX62-B-5PA; OC_MOUSER: 649-10118193-0001LF
X1-X3 = con-wago-500:W237-113: WAGO SCREW CLAMP; OC_CONRAD: EAN: 2050002355880; OC_FARNELL: unknown; OC_NEWARK: unknown
X4-X7 = con-ptr500:AK500/2: CONNECTOR; OC_CONRAD: EAN: 2050002823952; OC_FARNELL: unknown; OC_NEWARK: unknown